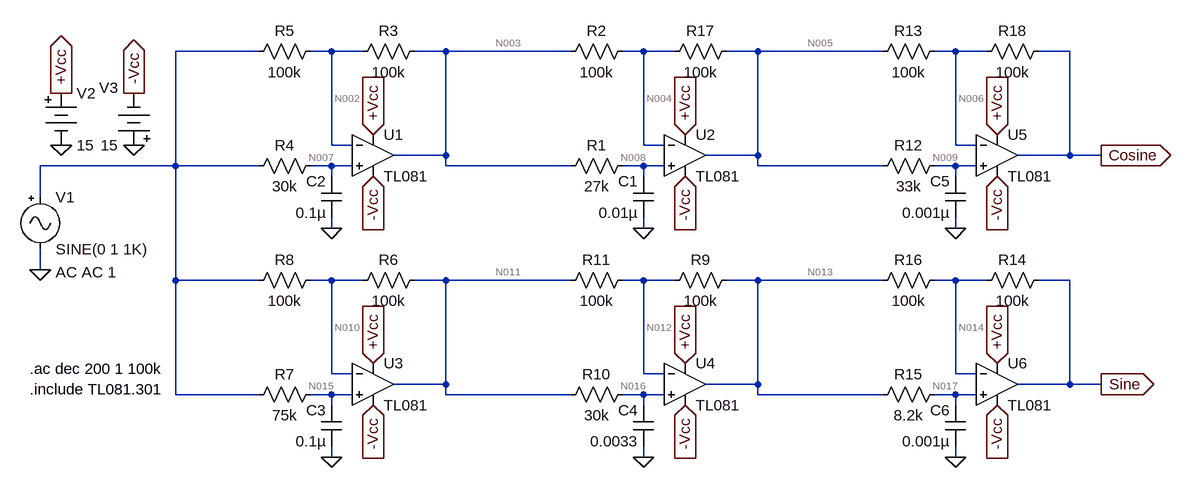
[diagram p0: schematic Realization of Bandwith Network.asc]
Realization of Bandwith Network.asc, the LTspice schematic file:
Version 4
SHEET 1 1304 680
WIRE -144 -32 -272 -32
WIRE -32 -32 -64 -32
WIRE 16 -32 -32 -32
WIRE 144 -32 96 -32
WIRE 336 -32 144 -32
WIRE 448 -32 416 -32
WIRE 496 -32 448 -32
WIRE 624 -32 576 -32
WIRE 816 -32 624 -32
WIRE 928 -32 896 -32
WIRE 976 -32 928 -32
WIRE 1104 -32 1056 -32
WIRE -32 112 -32 -32
WIRE 0 112 -32 112
WIRE 448 112 448 -32
WIRE 480 112 448 112
WIRE 928 112 928 -32
WIRE 960 112 928 112
WIRE 144 128 144 -32
WIRE 144 128 64 128
WIRE 624 128 624 -32
WIRE 624 128 544 128
WIRE 1104 128 1104 -32
WIRE 1104 128 1024 128
WIRE 1152 128 1104 128
WIRE -272 144 -272 -32
WIRE -272 144 -480 144
WIRE -144 144 -272 144
WIRE -32 144 -64 144
WIRE 0 144 -32 144
WIRE 144 144 144 128
WIRE 336 144 144 144
WIRE 448 144 416 144
WIRE 480 144 448 144
WIRE 624 144 624 128
WIRE 816 144 624 144
WIRE 928 144 896 144
WIRE 960 144 928 144
WIRE -32 160 -32 144
WIRE 448 160 448 144
WIRE 928 160 928 144
WIRE -480 192 -480 144
WIRE -32 240 -32 224
WIRE 448 240 448 224
WIRE 928 240 928 224
WIRE -480 304 -480 272
WIRE -272 320 -272 144
WIRE -144 320 -272 320
WIRE -32 320 -64 320
WIRE 16 320 -32 320
WIRE 144 320 96 320
WIRE 336 320 144 320
WIRE 448 320 416 320
WIRE 496 320 448 320
WIRE 624 320 576 320
WIRE 816 320 624 320
WIRE 928 320 896 320
WIRE 976 320 928 320
WIRE 1104 320 1056 320
WIRE -32 464 -32 320
WIRE 0 464 -32 464
WIRE 448 464 448 320
WIRE 480 464 448 464
WIRE 928 464 928 320
WIRE 960 464 928 464
WIRE 144 480 144 320
WIRE 144 480 64 480
WIRE 624 480 624 320
WIRE 624 480 544 480
WIRE 1104 480 1104 320
WIRE 1104 480 1024 480
WIRE 1152 480 1104 480
WIRE -272 496 -272 320
WIRE -144 496 -272 496
WIRE -32 496 -64 496
WIRE 0 496 -32 496
WIRE 144 496 144 480
WIRE 336 496 144 496
WIRE 448 496 416 496
WIRE 480 496 448 496
WIRE 624 496 624 480
WIRE 816 496 624 496
WIRE 928 496 896 496
WIRE 960 496 928 496
WIRE -32 512 -32 496
WIRE 448 512 448 496
WIRE 928 512 928 496
WIRE -32 592 -32 576
WIRE 448 592 448 576
WIRE 928 592 928 576
FLAG 32 96 +Vcc
IOPIN 32 96 In
FLAG 32 160 -Vcc
IOPIN 32 160 In
FLAG 512 160 -Vcc
IOPIN 512 160 In
FLAG 512 96 +Vcc
IOPIN 512 96 In
FLAG 448 240 0
FLAG -32 240 0
FLAG -480 304 0
FLAG 32 448 +Vcc
IOPIN 32 448 In
FLAG 32 512 -Vcc
IOPIN 32 512 In
FLAG -32 592 0
FLAG 512 448 +Vcc
IOPIN 512 448 In
FLAG 512 512 -Vcc
IOPIN 512 512 In
FLAG 448 592 0
FLAG 992 160 -Vcc
IOPIN 992 160 In
FLAG 992 96 +Vcc
IOPIN 992 96 In
FLAG 928 240 0
FLAG 992 448 +Vcc
IOPIN 992 448 In
FLAG 992 512 -Vcc
IOPIN 992 512 In
FLAG 928 592 0
FLAG 1152 480 Sine
IOPIN 1152 480 Out
FLAG 1152 128 Cosine
IOPIN 1152 128 Out
FLAG -448 32 +Vcc
IOPIN -448 32 Out
FLAG -336 32 -Vcc
IOPIN -336 32 Out
FLAG -336 112 0
FLAG -448 112 0
SYMBOL OpAmps\\opamp2 32 64 R0
SYMATTR InstName U1
SYMATTR Value TL081
SYMBOL OpAmps\\opamp2 512 64 R0
SYMATTR InstName U2
SYMATTR Value TL081
SYMBOL res 432 128 R90
WINDOW 0 0 56 VBottom 2
WINDOW 3 32 56 VTop 2
SYMATTR InstName R1
SYMATTR Value 27k
SYMBOL cap 464 224 R180
WINDOW 0 24 56 Left 2
WINDOW 3 24 8 Left 2
SYMATTR InstName C1
SYMATTR Value 0.01µ
SYMBOL res 432 -48 R90
WINDOW 0 0 56 VBottom 2
WINDOW 3 32 56 VTop 2
SYMATTR InstName R2
SYMATTR Value 100k
SYMBOL res 112 -48 R90
WINDOW 0 0 56 VBottom 2
WINDOW 3 32 56 VTop 2
SYMATTR InstName R3
SYMATTR Value 100k
SYMBOL res -48 128 R90
WINDOW 0 0 56 VBottom 2
WINDOW 3 32 56 VTop 2
SYMATTR InstName R4
SYMATTR Value 30k
SYMBOL cap -16 224 R180
WINDOW 0 24 56 Left 2
WINDOW 3 24 8 Left 2
SYMATTR InstName C2
SYMATTR Value 0.1µ
SYMBOL res -48 -48 R90
WINDOW 0 0 56 VBottom 2
WINDOW 3 32 56 VTop 2
SYMATTR InstName R5
SYMATTR Value 100k
SYMBOL Misc\\signal -480 176 R0
WINDOW 123 24 132 Left 2
WINDOW 39 0 0 Left 0
SYMATTR Value2 AC AC 1
SYMATTR InstName V1
SYMBOL OpAmps\\opamp2 32 416 R0
SYMATTR InstName U3
SYMATTR Value TL081
SYMBOL res 112 304 R90
WINDOW 0 0 56 VBottom 2
WINDOW 3 32 56 VTop 2
SYMATTR InstName R6
SYMATTR Value 100k
SYMBOL res -48 480 R90
WINDOW 0 0 56 VBottom 2
WINDOW 3 32 56 VTop 2
SYMATTR InstName R7
SYMATTR Value 75k
SYMBOL cap -16 576 R180
WINDOW 0 24 56 Left 2
WINDOW 3 24 8 Left 2
SYMATTR InstName C3
SYMATTR Value 0.1µ
SYMBOL res -48 304 R90
WINDOW 0 0 56 VBottom 2
WINDOW 3 32 56 VTop 2
SYMATTR InstName R8
SYMATTR Value 100k
SYMBOL OpAmps\\opamp2 512 416 R0
SYMATTR InstName U4
SYMATTR Value TL081
SYMBOL res 592 304 R90
WINDOW 0 0 56 VBottom 2
WINDOW 3 32 56 VTop 2
SYMATTR InstName R9
SYMATTR Value 100k
SYMBOL res 432 480 R90
WINDOW 0 0 56 VBottom 2
WINDOW 3 32 56 VTop 2
SYMATTR InstName R10
SYMATTR Value 30k
SYMBOL cap 464 576 R180
WINDOW 0 24 56 Left 2
WINDOW 3 24 8 Left 2
SYMATTR InstName C4
SYMATTR Value 0.0033
SYMBOL res 432 304 R90
WINDOW 0 0 56 VBottom 2
WINDOW 3 32 56 VTop 2
SYMATTR InstName R11
SYMATTR Value 100k
SYMBOL OpAmps\\opamp2 992 64 R0
SYMATTR InstName U5
SYMATTR Value TL081
SYMBOL res 912 128 R90
WINDOW 0 0 56 VBottom 2
WINDOW 3 32 56 VTop 2
SYMATTR InstName R12
SYMATTR Value 33k
SYMBOL cap 944 224 R180
WINDOW 0 24 56 Left 2
WINDOW 3 24 8 Left 2
SYMATTR InstName C5
SYMATTR Value 0.001µ
SYMBOL res 912 -48 R90
WINDOW 0 0 56 VBottom 2
WINDOW 3 32 56 VTop 2
SYMATTR InstName R13
SYMATTR Value 100k
SYMBOL OpAmps\\opamp2 992 416 R0
SYMATTR InstName U6
SYMATTR Value TL081
SYMBOL res 1072 304 R90
WINDOW 0 0 56 VBottom 2
WINDOW 3 32 56 VTop 2
SYMATTR InstName R14
SYMATTR Value 100k
SYMBOL res 912 480 R90
WINDOW 0 0 56 VBottom 2
WINDOW 3 32 56 VTop 2
SYMATTR InstName R15
SYMATTR Value 8.2k
SYMBOL cap 944 576 R180
WINDOW 0 24 56 Left 2
WINDOW 3 24 8 Left 2
SYMATTR InstName C6
SYMATTR Value 0.001µ
SYMBOL res 912 304 R90
WINDOW 0 0 56 VBottom 2
WINDOW 3 32 56 VTop 2
SYMATTR InstName R16
SYMATTR Value 100k
SYMBOL res 592 -48 R90
WINDOW 0 0 56 VBottom 2
WINDOW 3 32 56 VTop 2
SYMATTR InstName R17
SYMATTR Value 100k
SYMBOL res 1072 -48 R90
WINDOW 0 0 56 VBottom 2
WINDOW 3 32 56 VTop 2
SYMATTR InstName R18
SYMATTR Value 100k
SYMBOL Misc\\battery -448 16 R0
WINDOW 123 0 0 Left 0
WINDOW 39 0 0 Left 0
SYMATTR InstName V2
SYMATTR Value 15
SYMBOL Misc\\battery -336 128 R180
WINDOW 0 24 104 Left 2
WINDOW 3 24 16 Left 2
WINDOW 123 0 0 Left 0
WINDOW 39 0 0 Left 0
SYMATTR InstName V3
SYMATTR Value 15
TEXT -496 488 Left 2 !.include TL081.301
TEXT -496 456 Left 2 !.ac dec 200 1 100k

The netlist it stands for:
* Realization of Bandwith Network.asc
XU1 N007 N002 +Vcc -Vcc N003 TL081  ; pins In+ In- V+ V- OUT
XU2 N008 N004 +Vcc -Vcc N005 TL081  ; pins In+ In- V+ V- OUT
R1 N008 N003 27k
C1 0 N008 0.01µ
R2 N004 N003 100k
R3 N003 N002 100k
R4 N007 N001 30k
C2 0 N007 0.1µ
R5 N002 N001 100k
V1 N001 0 SINE(0 1 1K) AC AC 1
XU3 N015 N010 +Vcc -Vcc N011 TL081  ; pins In+ In- V+ V- OUT
R6 N011 N010 100k
R7 N015 N001 75k
C3 0 N015 0.1µ
R8 N010 N001 100k
XU4 N016 N012 +Vcc -Vcc N013 TL081  ; pins In+ In- V+ V- OUT
R9 N013 N012 100k
R10 N016 N011 30k
C4 0 N016 0.0033
R11 N012 N011 100k
XU5 N009 N006 +Vcc -Vcc Cosine TL081  ; pins In+ In- V+ V- OUT
R12 N009 N005 33k
C5 0 N009 0.001µ
R13 N006 N005 100k
XU6 N017 N014 +Vcc -Vcc Sine TL081  ; pins In+ In- V+ V- OUT
R14 Sine N014 100k
R15 N017 N013 8.2k
C6 0 N017 0.001µ
R16 N014 N013 100k
R17 N005 N004 100k
R18 Cosine N006 100k
V2 +Vcc 0 15
V3 0 -Vcc 15
.include TL081.301
.ac dec 200 1 100k
.backanno
.end

* Results of the author's LTspice run, read from the files saved beside the schematic
* Operating Point, zero values left out:
*   V(n003) = 23.74 µV
*   V(-vcc) = -15 V
*   V(+vcc) = 15 V
*   V(n002) = 9.619 µV
*   V(n007) = -1.352 µV
*   V(n005) = 47.76 µV
*   V(n004) = 33.5 µV
*   V(n008) = 22.53 µV
*   V(n011) = 19.69 µV
*   V(n010) = 7.592 µV
*   V(n015) = -3.379 µV
*   V(n013) = 43.43 µV
*   V(n012) = 29.31 µV
*   V(n016) = 18.34 µV
*   V(cosine) = 71.23 µV
*   V(n006) = 57.24 µV
*   V(n009) = 46.27 µV
*   V(sine) = 69.14 µV
*   V(n014) = 54.03 µV
*   V(n017) = 43.06 µV
*   I(R1) = -45.05 pA
*   I(R2) = 97.53 pA
*   I(R3) = 141.2 pA
*   I(R4) = -45.05 pA
*   I(R5) = 96.19 pA
*   I(R6) = 121 pA
*   I(R7) = -45.05 pA
*   I(R8) = 75.92 pA
*   I(R9) = 141.2 pA
*   I(R10) = -45.05 pA
*   I(R11) = 96.18 pA
*   I(R12) = -45.05 pA
*   I(R13) = 94.82 pA
*   I(R14) = 151.1 pA
*   I(R15) = -45.05 pA
*   I(R16) = 106 pA
*   I(R17) = 142.6 pA
*   I(R18) = 139.9 pA
*   I(V1) = 82 pA
*   I(V2) = -85.16 mA
*   I(V3) = -85.17 mA
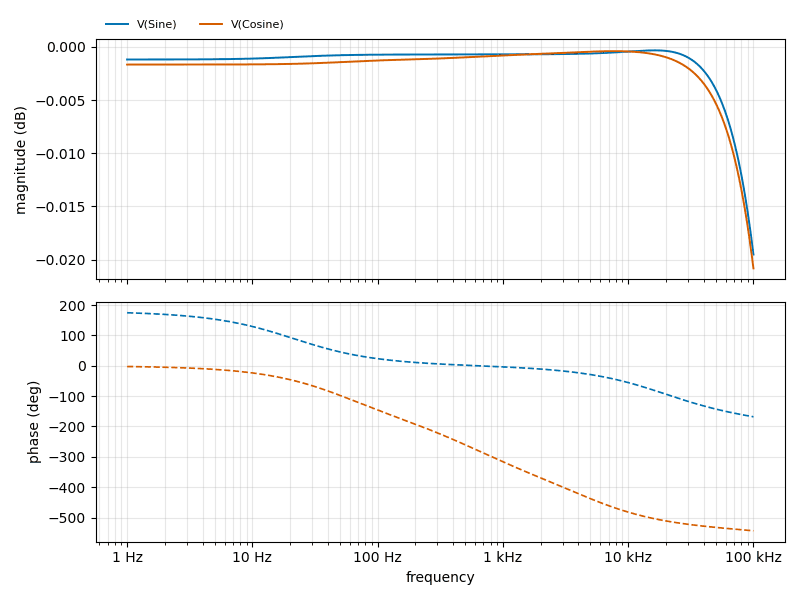
[diagram p1: AC Analysis of Realization of Bandwith Network.asc, plotted from the saved traces]
* AC Analysis, 1 run:
*   V(Sine): -0.00 dB at 1 Hz, -0.02 dB at 100 kHz, peak -0.00 dB at 16.22 kHz
*   V(Cosine): -0.00 dB at 1 Hz, -0.02 dB at 100 kHz, peak -0.00 dB at 7.674 kHz